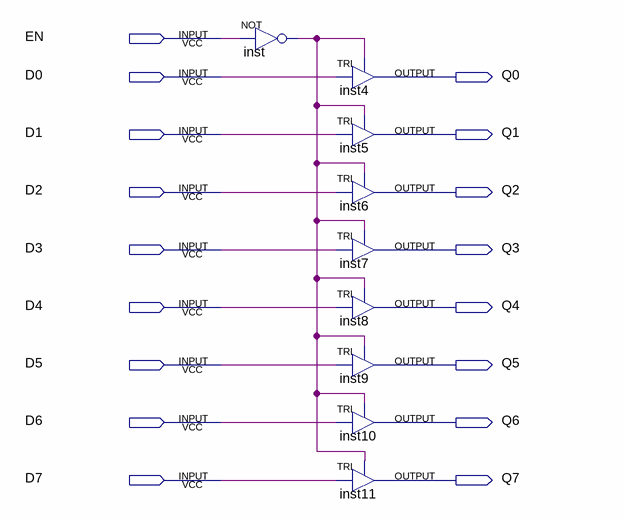
[diagram p0: schematic sheet]
// Quartus schematic 8tristate.bdf as structural Verilog: 9 symbols, 17 pins
module \8tristate  (
  input  EN,
  input  D0,
  input  D1,
  input  D2,
  input  D3,
  input  D4,
  input  D5,
  input  D6,
  input  D7,
  output Q0,
  output Q1,
  output Q2,
  output Q3,
  output Q4,
  output Q5,
  output Q6,
  output Q7
);

  wire inst_out;

  not inst (inst_out, EN);
  TRI inst4 (.IN(D0), .OE(inst_out), .OUT(Q0));
  TRI inst5 (.IN(D1), .OE(inst_out), .OUT(Q1));
  TRI inst6 (.IN(D2), .OE(inst_out), .OUT(Q2));
  TRI inst7 (.IN(D3), .OE(inst_out), .OUT(Q3));
  TRI inst8 (.IN(D4), .OE(inst_out), .OUT(Q4));
  TRI inst9 (.IN(D5), .OE(inst_out), .OUT(Q5));
  TRI inst10 (.IN(D6), .OE(inst_out), .OUT(Q6));
  TRI inst11 (.IN(D7), .OE(inst_out), .OUT(Q7));
endmodule
